# EAGLE schematic 31813C (EAGLE 7.5.0)

## Sheet 1 of 2
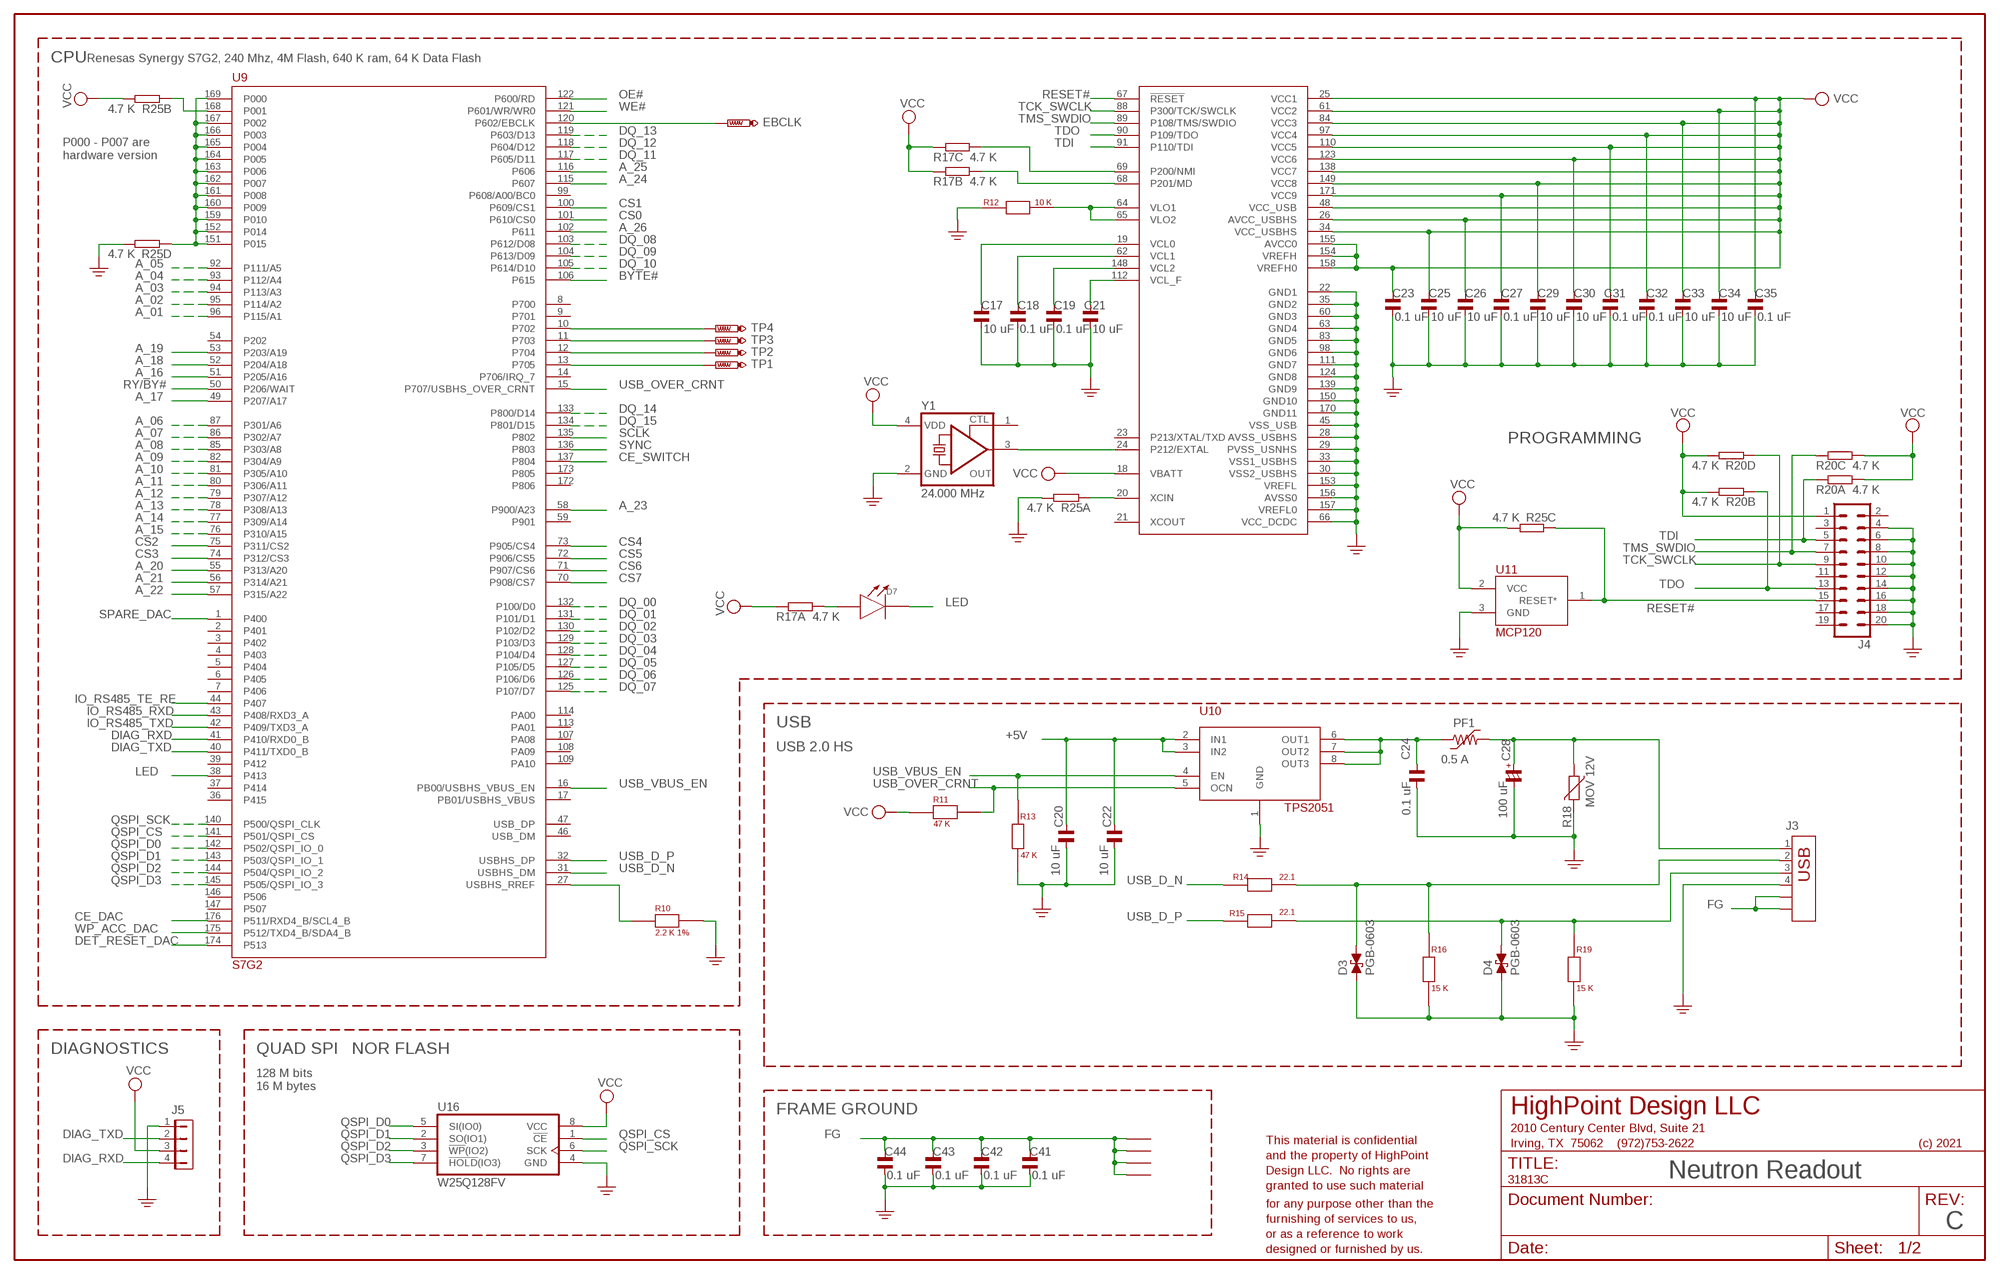
[diagram p0: schematic, sheet 1]

### Parts
C17  10 uF  CAP_SMD-0603  [0603]
C18  0.1 uF  CAP_SMD-0603  [0603]
C19  0.1 uF  CAP_SMD-0603  [0603]
C20  10 uF  CAP_SMD-0603  [0603]
C21  10 uF  CAP_SMD-0603  [0603]
C22  10 uF  CAP_SMD-0603  [0603]
C23  0.1 uF  CAP_SMD-0603  [0603]
C24  0.1 uF  CAP_SMD-0603  [0603]
C25  10 uF  CAP_SMD-0603  [0603]
C26  10 uF  CAP_SMD-0603  [0603]
C27  0.1 uF  CAP_SMD-0603  [0603]
C28  100 uF  CAP_POL-E  [CSV-E/F]
C29  10 uF  CAP_SMD-0603  [0603]
C30  10 uF  CAP_SMD-0603  [0603]
C31  0.1 uF  CAP_SMD-0603  [0603]
C32  0.1 uF  CAP_SMD-0603  [0603]
C33  10 uF  CAP_SMD-0603  [0603]
C34  10 uF  CAP_SMD-0603  [0603]
C35  0.1 uF  CAP_SMD-0603  [0603]
C41  0.1 uF  CAP_SMD-0603  [0603]
C42  0.1 uF  CAP_SMD-0603  [0603]
C43  0.1 uF  CAP_SMD-0603  [0603]
C44  0.1 uF  CAP_SMD-0603  [0603]
D3  PGB-0603  [PGB-0603]
D4  PGB-0603  [PGB-0603]
D7  LED0805  [D0805]
EBCLK  TP  [TP8040]
J3  CON-USB-292303-1  [USB]
J4  ML20  [ML20]
J5  MTA04  [MTA04-100]
M1  MNT-125  [MNT-125]
M2  MNT-125  [MNT-125]
M3  MNT-125  [MNT-125]
M4  MNT-125  [MNT-125]
PF1  0.5 A  PTC-F1206  [F1206]
R10  2.2 K 1%  RES-0603-H  [0603]
R11  47 K  RES-0603-H  [0603]
R12  10 K  RES-0603-H  [0603]
R13  47 K  RES-0603-V  [0603]
R14  22.1  RES-0603-H  [0603]
R15  22.1  RES-0603-H  [0603]
R16  15 K  RES-0603-V  [0603]
R17  4.7 K  R_38V  [RNET-4R-38V]
R18  MOV 12V  VARISTOR-0603  [R0603]
R19  15 K  RES-0603-V  [0603]
R20  4.7 K  R_38V  [RNET-4R-38V]
R25  4.7 K  R_38V  [RNET-4R-38V]
TP1  TP  [TP8040]
TP2  TP  [TP8040]
TP3  TP  [TP8040]
TP4  TP  [TP8040]
U9  S7G2  S7G2-176  [LQFP176]
U10  TPS2051  [SOIC-8-SPECIAL]
U11  MCP120  [SOT23]
U16  W25Q128FV  IS25LQ080B-JB  [SO08-JB]
Y1  24.000 MHz  ASFL1  [ASFL1]

### Nets
+5V: C20.2 C22.2 U10.2(IN1) U10.3(IN2) ; also sheet 2
A_01: U9.96(P115/A1) ; also sheet 2
A_02: U9.95(P114/A2) ; also sheet 2
A_03: U9.94(P113/A3) ; also sheet 2
A_04: U9.93(P112/A4) ; also sheet 2
A_05: U9.92(P111/A5) ; also sheet 2
A_06: U9.87(P301/A6) ; also sheet 2
A_07: U9.86(P302/A7) ; also sheet 2
A_08: U9.85(P303/A8) ; also sheet 2
A_09: U9.82(P304/A9) ; also sheet 2
A_10: U9.81(P305/A10) ; also sheet 2
A_11: U9.80(P306/A11) ; also sheet 2
A_12: U9.79(P307/A12) ; also sheet 2
A_13: U9.78(P308/A13) ; also sheet 2
A_14: U9.77(P309/A14) ; also sheet 2
A_15: U9.76(P310/A15) ; also sheet 2
A_16: U9.51(P205/A16) ; also sheet 2
A_17: U9.49(P207/A17) ; also sheet 2
A_18: U9.52(P204/A18) ; also sheet 2
A_19: U9.53(P203/A19) ; also sheet 2
A_20: U9.55(P313/A20) ; also sheet 2
A_21: U9.56(P314/A21) ; also sheet 2
A_22: U9.57(P315/A22) ; also sheet 2
A_23: U9.58(P900/A23) ; also sheet 2
A_24: U9.115(P607) ; also sheet 2
A_25: U9.116(P606) ; also sheet 2
A_26: U9.102(P611) ; also sheet 2
BYTE#: U9.106(P615) ; also sheet 2
CE_DAC: U9.176(P511/RXD4_B/SCL4_B) ; also sheet 2
CE_SWITCH: U9.137(P804) ; also sheet 2
CS0: U9.101(P610/CS0) ; also sheet 2
CS1: U9.100(P609/CS1) ; also sheet 2
CS2: U9.75(P311/CS2) ; also sheet 2
CS3: U9.74(P312/CS3) ; also sheet 2
CS4: U9.73(P905/CS4) ; also sheet 2
CS5: U9.72(P906/CS5) ; also sheet 2
CS6: U9.71(P907/CS6) ; also sheet 2
CS7: U9.70(P908/CS7) ; also sheet 2
DET_RESET_DAC: U9.174(P513) ; also sheet 2
DIAG_RXD: J5.4 U9.41(P410/RXD0_B)
DIAG_TXD: J5.2 U9.40(P411/TXD0_B)
DQ_00: U9.132(P100/D0) ; also sheet 2
DQ_01: U9.131(P101/D1) ; also sheet 2
DQ_02: U9.130(P102/D2) ; also sheet 2
DQ_03: U9.129(P103/D3) ; also sheet 2
DQ_04: U9.128(P104/D4) ; also sheet 2
DQ_05: U9.127(P105/D5) ; also sheet 2
DQ_06: U9.126(P106/D6) ; also sheet 2
DQ_07: U9.125(P107/D7) ; also sheet 2
DQ_08: U9.103(P612/D08) ; also sheet 2
DQ_09: U9.104(P613/D09) ; also sheet 2
DQ_10: U9.105(P614/D10) ; also sheet 2
DQ_11: U9.117(P605/D11) ; also sheet 2
DQ_12: U9.118(P604/D12) ; also sheet 2
DQ_13: U9.119(P603/D13) ; also sheet 2
DQ_14: U9.133(P800/D14) ; also sheet 2
DQ_15: U9.134(P801/D15) ; also sheet 2
FG: C41.2 C42.2 C43.2 C44.2 J3.S1 J3.S2 M1.1 M2.1 M3.1 M4.1
GND: C17.1 C18.1 C19.1 C20.1 C21.1 C22.1 C23.1 C24.1 C25.1 C26.1 C27.1 C28.- C29.1 C30.1 C31.1 C32.1 C33.1 C34.1 C35.1 C41.1 C42.1 C43.1 C44.1 D3.1 D4.1 J3.4 J4.4 J4.6 J4.8 J4.10 J4.12 J4.14 J4.16 J4.18 J4.20 J5.1 R10.2 R12.1 R13.1 R16.1 R18.2 R19.1 R25.5 R25.8 U9.22(GND1) U9.28(AVSS_USBHS) U9.29(PVSS_USNHS) U9.30(VSS2_USBHS) U9.33(VSS1_USBHS) U9.35(GND2) U9.45(VSS_USB) U9.60(GND3) U9.63(GND4) U9.66(VCC_DCDC) U9.83(GND5) U9.98(GND6) U9.111(GND7) U9.124(GND8) U9.139(GND9) U9.150(GND10) U9.153(VREFL) U9.156(AVSS0) U9.157(VREFL0) U9.170(GND11) U10.1(GND) U11.3(GND) U16.4(GND) Y1.2(GND) ; supply symbol labelled GND-DIGITAL ; also sheet 2
IO_RS485_RXD: U9.43(P408/RXD3_A) ; also sheet 2
IO_RS485_TE_RE: U9.44(P407) ; also sheet 2
IO_RS485_TXD: U9.42(P409/TXD3_A) ; also sheet 2
LED: D7.C U9.38(P413)
N$1: R12.2 U9.64(VLO1) U9.65(VLO2)
N$2: R17.7 U9.68(P201/MD)
N$3: R17.6 U9.69(P200/NMI)
N$4: C17.2 U9.19(VCL0)
N$5: C18.2 U9.62(VCL1)
N$6: C19.2 U9.148(VCL2)
N$7: C21.2 U9.112(VCL_F)
N$8: U9.24(P212/EXTAL) Y1.3(OUT)
N$11: C24.2 PF1.1 U10.6(OUT1) U10.7(OUT2) U10.8(OUT3)
N$12: C28.+ J3.1 PF1.2 R18.1
N$13: D3.2 J3.2 R14.2 R16.2
N$14: R10.1 U9.27(USBHS_RREF)
N$15: D4.2 J3.3 R15.2 R19.2
N$23: TP3.1(TP) U9.11(P703)
N$24: TP4.1(TP) U9.10(P702)
N$25: TP1.1(TP) U9.13(P705)
N$26: TP2.1(TP) U9.12(P704)
N$36: R25.1 U9.20(XCIN)
N$37: D7.A R17.8
N$38: R25.2 U9.168(P001)
N$39: R25.4 U9.151(P015) U9.152(P014) U9.159(P010) U9.160(P009) U9.161(P008) U9.162(P007) U9.163(P006) U9.164(P005) U9.165(P004) U9.166(P003) U9.167(P002) U9.169(P000)
N$41: EBCLK.1(TP) U9.120(P602/EBCLK)
OE#: U9.122(P600/RD) ; also sheet 2
QSPI_CS: U9.141(P501/QSPI_CS) U16.1(!CE!)
QSPI_D0: U9.142(P502/QSPI_IO_0) U16.5(SI(IO0))
QSPI_D1: U9.143(P503/QSPI_IO_1) U16.2(SO(IO1))
QSPI_D2: U9.144(P504/QSPI_IO_2) U16.3(!WP!(IO2))
QSPI_D3: U9.145(P505/QSPI_IO_3) U16.7(!HOLD!(IO3))
QSPI_SCK: U9.140(P500/QSPI_CLK) U16.6(SCK)
RESET#: J4.15 R25.3 U9.67(!RESET) U11.1(RESET*)
RY/BY#: U9.50(P206/WAIT) ; also sheet 2
SCLK: U9.135(P802) ; also sheet 2
SPARE_DAC: U9.1(P400) ; also sheet 2
SYNC: U9.136(P803) ; also sheet 2
TCK_SWCLK: J4.9 R20.4 U9.88(P300/TCK/SWCLK)
TDI: J4.5 R20.1 U9.91(P110/TDI)
TDO: J4.13 R20.2 U9.90(P109/TDO)
TMS_SWDIO: J4.7 R20.3 U9.89(P108/TMS/SWDIO)
USB_D_N [diff pairs]: R14.1 U9.31(USBHS_DM)
USB_D_P [diff pairs]: R15.1 U9.32(USBHS_DP)
USB_OVER_CRNT: R11.2 U9.15(P707/USBHS_OVER_CRNT) U10.5(OCN)
USB_VBUS_EN: R13.2 U9.16(PB00/USBHS_VBUS_EN) U10.4(EN)
VCC: C23.2 C25.2 C26.2 C27.2 C29.2 C30.2 C31.2 C32.2 C33.2 C34.2 C35.2 J4.1 J5.3 R11.1 R17.1 R17.2 R17.3 R20.5 R20.6 R20.7 R20.8 R25.6 R25.7 U9.18(VBATT) U9.25(VCC1) U9.26(AVCC_USBHS) U9.34(VCC_USBHS) U9.48(VCC_USB) U9.61(VCC2) U9.84(VCC3) U9.97(VCC4) U9.110(VCC5) U9.123(VCC6) U9.138(VCC7) U9.149(VCC8) U9.154(VREFH) U9.155(AVCC0) U9.158(VREFH0) U9.171(VCC9) U11.2(VCC) U16.8(VCC) Y1.4(VDD) ; also sheet 2
WE#: U9.121(P601/WR/WR0) ; also sheet 2
WP_ACC_DAC: U9.175(P512/TXD4_B/SDA4_B) ; also sheet 2
Unconnected: J4.2 J4.3 J4.11 J4.17 J4.19 R17.4 R17.5 U9.2(P401) U9.3(P402) U9.4(P403) U9.5(P404) U9.6(P405) U9.7(P406) U9.8(P700) U9.9(P701) U9.14(P706/IRQ_7) U9.17(PB01/USBHS_VBUS) U9.21(XCOUT) U9.23(P213/XTAL/TXD) U9.36(P415) U9.37(P414) U9.39(P412) U9.46(USB_DM) U9.47(USB_DP) U9.54(P202) U9.59(P901) U9.99(P608/A00/BC0) U9.107(PA08) U9.108(PA09) U9.109(PA10) U9.113(PA01) U9.114(PA00) U9.146(P506) U9.147(P507) U9.172(P806) U9.173(P805) Y1.1(CTL)

### Notes on the sheet
- CPU | Renesas Synergy S7G2, 240 Mhz, 4M Flash, 640 K ram, 64 K Data Flash
- P000 - P007 are
  hardware version
- PROGRAMMING
- USB
- USB 2.0 HS
- DIAGNOSTICS | QUAD SPI   NOR FLASH
- 128 M bits
  16 M bytes
- FRAME GROUND
- Neutron Readout
- C

## Sheet 2 of 2
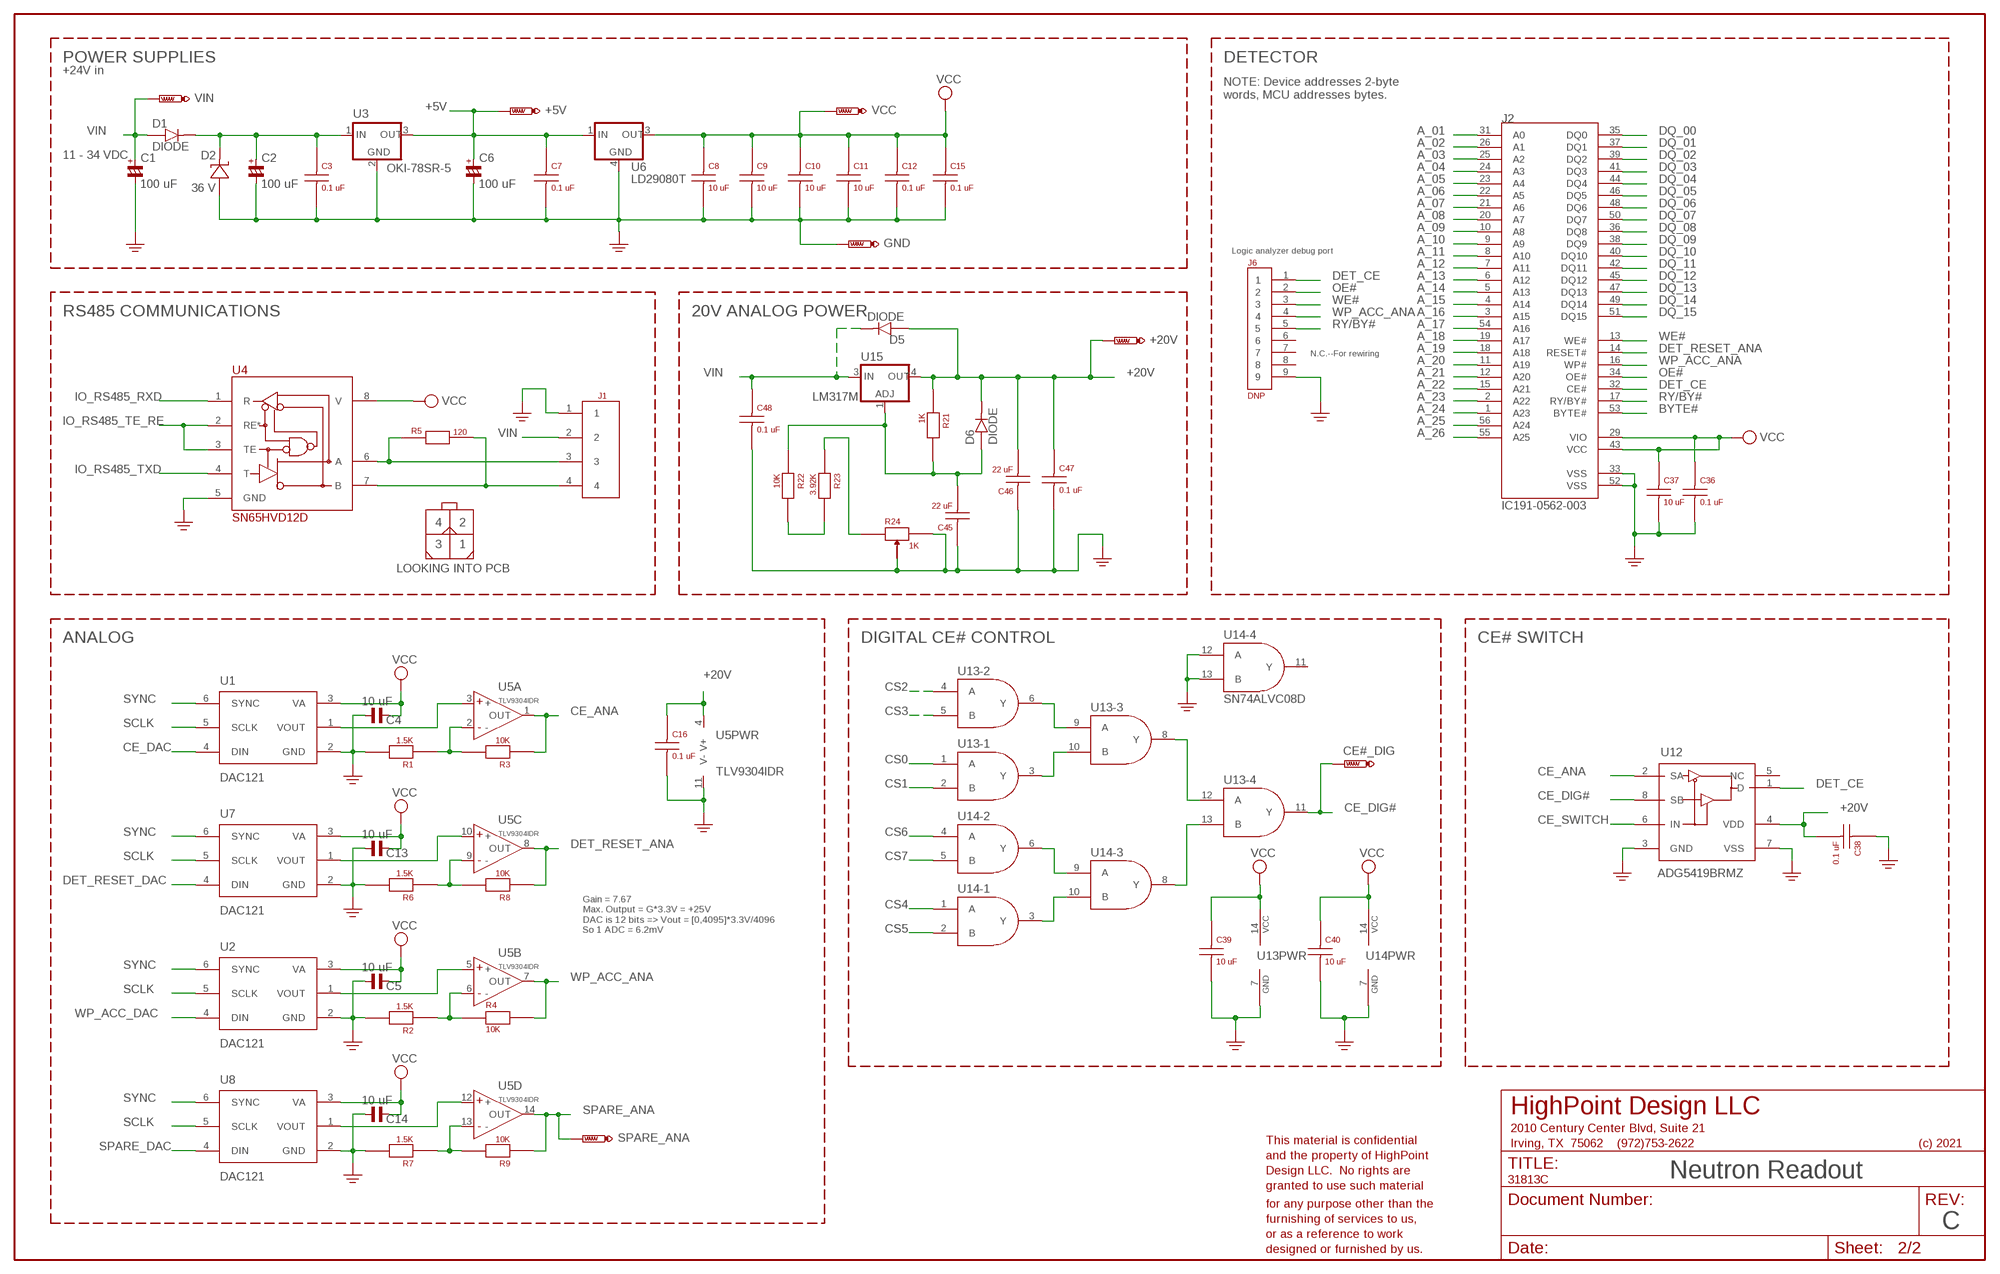
[diagram p1: schematic, sheet 2]

### Parts
+5V  TP  [TP8040]
+20V  TP  [TP8040]
C1  100 uF  CAP_POL-E  [CSV-E/F]
C2  100 uF  CAP_POL-E  [CSV-E/F]
C3  0.1 uF  CAP-0603  [0603]
C4  10 uF  CAP_SMD-0603  [0603]
C5  10 uF  CAP_SMD-0603  [0603]
C6  100 uF  CAP_POL-E  [CSV-E/F]
C7  0.1 uF  CAP-0603  [0603]
C8  10 uF  CAP-0603  [0603]
C9  10 uF  CAP-0603  [0603]
C10  10 uF  CAP-0603  [0603]
C11  10 uF  CAP-0603  [0603]
C12  0.1 uF  CAP-0603  [0603]
C13  10 uF  CAP_SMD-0603  [0603]
C14  10 uF  CAP_SMD-0603  [0603]
C15  0.1 uF  CAP-0603  [0603]
C16  0.1 uF  CAP-0603  [0603]
C36  0.1 uF  CAP-0603  [0603]
C37  10 uF  CAP-0603  [0603]
C38  0.1 uF  CAP-0603  [0603]
C39  10 uF  CAP-0603  [0603]
C40  10 uF  CAP-0603  [0603]
C45  22 uF  CAP-1206  [C1206]
C46  22 uF  CAP-1206  [C1206]
C47  0.1 uF  CAP-0603  [0603]
C48  0.1 uF  CAP-0603  [0603]
CE#_DIG  TP  [TP8040]
D1  DIODE  [SOD-123_MINI-SMA]
D2  36 V  TRANSORB  [SMB]
D5  DIODE  [SOD-123_MINI-SMA]
D6  DIODE  [SOD-123_MINI-SMA]
GND  TP  [TP8040]
J1  MICRO-FIT-4POS  [43045-0412]
J2  IC191-0562-003  [IC1910562003]
J6  DNP  CON-9P-100  [9P-100]
R1  1.5K  RES-0603-H  [0603]
R2  1.5K  RES-0603-H  [0603]
R3  10K  RES-0603-H  [0603]
R4  10K  RES-0603-H  [0603]
R5  120  RES-0603-H  [0603]
R6  1.5K  RES-0603-H  [0603]
R7  1.5K  RES-0603-H  [0603]
R8  10K  RES-0603-H  [0603]
R9  10K  RES-0603-H  [0603]
R21  1K  RES-0603-H  [0603]
R22  10K  RES-0603-H  [0603]
R23  3.92K  RES-0603-H  [0603]
R24  1K  PT10XV10  [POT-V10]
SPARE_ANA  TP  [TP8040]
U1  DAC121  [SOT23-6]
U2  DAC121  [SOT23-6]
U3  OKI-78SR-5  PS-OKI-78SR  [PS-OKI-78SR]
U4  SN65HVD12D  [SOIC-08-150]
U5  TLV9304IDR  [SO14]
U6  LD29080T  [DPAK]
U7  DAC121  [SOT23-6]
U8  DAC121  [SOT23-6]
U12  ADG5419BRMZ  [RM_8_ADI]
U13  SN74ALVC08D  [D14]
U14  SN74ALVC08D  [D14]
U15  LM317M  [DPAK]
VCC  TP  [TP8040]
VIN  TP  [TP8040]

### Nets
+5V: +5V.1(TP) C6.+ C7.1 U3.3(OUT) U6.1(IN) ; also sheet 1
+20V: +20V.1(TP) C16.1 C38.2 C46.2 C47.1 D5.A D6.C R21.1 U5.4(PWR:V+) U12.4(VDD) U15.4(OUT)
A_01: J2.31(A0) ; also sheet 1
A_02: J2.26(A1) ; also sheet 1
A_03: J2.25(A2) ; also sheet 1
A_04: J2.24(A3) ; also sheet 1
A_05: J2.23(A4) ; also sheet 1
A_06: J2.22(A5) ; also sheet 1
A_07: J2.21(A6) ; also sheet 1
A_08: J2.20(A7) ; also sheet 1
A_09: J2.10(A8) ; also sheet 1
A_10: J2.9(A9) ; also sheet 1
A_11: J2.8(A10) ; also sheet 1
A_12: J2.7(A11) ; also sheet 1
A_13: J2.6(A12) ; also sheet 1
A_14: J2.5(A13) ; also sheet 1
A_15: J2.4(A14) ; also sheet 1
A_16: J2.3(A15) ; also sheet 1
A_17: J2.54(A16) ; also sheet 1
A_18: J2.19(A17) ; also sheet 1
A_19: J2.18(A18) ; also sheet 1
A_20: J2.11(A19) ; also sheet 1
A_21: J2.12(A20) ; also sheet 1
A_22: J2.15(A21) ; also sheet 1
A_23: J2.2(A22) ; also sheet 1
A_24: J2.1(A23) ; also sheet 1
A_25: J2.56(A24) ; also sheet 1
A_26: J2.55(A25) ; also sheet 1
BYTE#: J2.53(BYTE#) ; also sheet 1
CE_ANA: R3.1 U5.1(A:OUT) U12.2(SA)
CE_DAC: U1.4(DIN) ; also sheet 1
CE_DIG#: CE#_DIG.1(TP) U12.8(SB) U13.11(-4:Y)
CE_SWITCH: U12.6(IN) ; also sheet 1
CS0: U13.1(-1:A) ; also sheet 1
CS1: U13.2(-1:B) ; also sheet 1
CS2: U13.4(-2:A) ; also sheet 1
CS3: U13.5(-2:B) ; also sheet 1
CS4: U14.1(-1:A) ; also sheet 1
CS5: U14.2(-1:B) ; also sheet 1
CS6: U14.4(-2:A) ; also sheet 1
CS7: U14.5(-2:B) ; also sheet 1
DATA_N [diff pairs]: J1.4 R5.2 U4.7(B)
DATA_P [diff pairs]: J1.3 R5.1 U4.6(A)
DET_CE: J2.32(CE#) J6.1 U12.1(D)
DET_RESET_ANA: J2.14(RESET#) R8.1 U5.8(C:OUT)
DET_RESET_DAC: U7.4(DIN) ; also sheet 1
DQ_00: J2.35(DQ0) ; also sheet 1
DQ_01: J2.37(DQ1) ; also sheet 1
DQ_02: J2.39(DQ2) ; also sheet 1
DQ_03: J2.41(DQ3) ; also sheet 1
DQ_04: J2.44(DQ4) ; also sheet 1
DQ_05: J2.46(DQ5) ; also sheet 1
DQ_06: J2.48(DQ6) ; also sheet 1
DQ_07: J2.50(DQ7) ; also sheet 1
DQ_08: J2.36(DQ8) ; also sheet 1
DQ_09: J2.38(DQ9) ; also sheet 1
DQ_10: J2.40(DQ10) ; also sheet 1
DQ_11: J2.42(DQ11) ; also sheet 1
DQ_12: J2.45(DQ12) ; also sheet 1
DQ_13: J2.47(DQ13) ; also sheet 1
DQ_14: J2.49(DQ14) ; also sheet 1
DQ_15: J2.51(DQ15) ; also sheet 1
GND: C1.- C2.- C3.2 C4.1 C5.1 C6.- C7.2 C8.2 C9.2 C10.2 C11.2 C12.2 C13.1 C14.1 C15.2 C16.2 C36.2 C37.2 C38.1 C39.2 C40.2 C45.1 C46.1 C47.2 C48.2 D2.A GND.1(TP) J1.1 J2.33(VSS) J2.52(VSS) J6.9 R1.2 R2.2 R6.2 R7.2 R24.2 R24.3 U1.2(GND) U2.2(GND) U3.2(GND) U4.5(GND) U5.11(PWR:V-) U6.4(GND) U7.2(GND) U8.2(GND) U12.3(GND) U12.7(VSS) U13.7(PWR:GND) U14.7(PWR:GND) U14.12(-4:A) U14.13(-4:B) ; supply symbol labelled GND-DIGITAL ; also sheet 1
IO_RS485_RXD: U4.1(R) ; also sheet 1
IO_RS485_TE_RE: U4.2(RE*) U4.3(TE) ; also sheet 1
IO_RS485_TXD: U4.4(T) ; also sheet 1
N$9: U1.1(VOUT) U5.3(A:+)
N$10: U5.10(C:+) U7.1(VOUT)
N$16: R1.1 R3.2 U5.2(A:-)
N$17: U2.1(VOUT) U5.5(B:+)
N$18: R6.1 R8.2 U5.9(C:-)
N$19: R2.1 R4.1 U5.6(B:-)
N$20: U5.12(D:+) U8.1(VOUT)
N$21: R7.1 R9.2 U5.13(D:-)
N$22: C2.+ C3.1 D1.C D2.C U3.1(IN)
N$27: U13.6(-2:Y) U13.9(-3:A)
N$28: U13.3(-1:Y) U13.10(-3:B)
N$29: U14.6(-2:Y) U14.9(-3:A)
N$30: U14.3(-1:Y) U14.10(-3:B)
N$31: U13.8(-3:Y) U13.12(-4:A)
N$32: U13.13(-4:B) U14.8(-3:Y)
N$33: C45.2 D6.A R21.2 R22.1 U15.1(ADJ)
N$34: R22.2 R23.2
N$35: R23.1 R24.1
OE#: J2.34(OE#) J6.2 ; also sheet 1
RY/BY#: J2.17(RY/BY#) J6.5 ; also sheet 1
SCLK: U1.5(SCLK) U2.5(SCLK) U7.5(SCLK) U8.5(SCLK) ; also sheet 1
SPARE_ANA: R9.1 SPARE_ANA.1(TP) U5.14(D:OUT)
SPARE_DAC: U8.4(DIN) ; also sheet 1
SYNC: U1.6(SYNC) U2.6(SYNC) U7.6(SYNC) U8.6(SYNC) ; also sheet 1
VCC: C4.2 C5.2 C8.1 C9.1 C10.1 C11.1 C12.1 C13.2 C14.2 C15.1 C36.1 C37.1 C39.1 C40.1 J2.29(VIO) J2.43(VCC) U1.3(VA) U2.3(VA) U4.8(V) U6.3(OUT) U7.3(VA) U8.3(VA) U13.14(PWR:VCC) U14.14(PWR:VCC) VCC.1(TP) ; also sheet 1
VIN: C1.+ C48.1 D1.A D5.C J1.2 U15.3(IN) VIN.1(TP)
WE#: J2.13(WE#) J6.3 ; also sheet 1
WP_ACC_ANA: J2.16(WP#) J6.4 R4.2 U5.7(B:OUT)
WP_ACC_DAC: U2.4(DIN) ; also sheet 1
Unconnected: J6.6 J6.7 J6.8 U12.5(NC) U14.11(-4:Y)

### Notes on the sheet
- POWER SUPPLIES | DETECTOR
- +24V in
- NOTE: Device addresses 2-byte
  words, MCU addresses bytes.
- 11 - 34 VDC
- Logic analyzer debug port
- RS485 COMMUNICATIONS | 20V ANALOG POWER
- N.C.--For rewiring
- ANALOG | DIGITAL CE# CONTROL | CE# SWITCH
- Gain = 7.67
  Max. Output = G*3.3V = +25V
  DAC is 12 bits => Vout = [0,4095]*3.3V/4096
  So 1 ADC = 6.2mV
- Neutron Readout
- C

## Library data of the parts
+5V +20V CE#_DIG EBCLK GND SPARE_ANA TP1-TP4 VCC VIN = 31813 Neutron Readout PCB:TP: TEST PIN
C1 C2 C6 C28 = 31813 Neutron Readout PCB:CAP_POL: Polarized caps surface mount
C3 C7-C12 C15 C16 C36-C40 C45-C48 = 31813 Neutron Readout PCB:CAP: Surfave mount caps various sizes all non-polar
C4 C5 C13 C14 C17-C27 C29-C35 C41-C44 = 31813 Neutron Readout PCB:CAP_SMD: Surface mount caps
D1 D5 D6 = 31813 Neutron Readout PCB:DIODE: General purpose diode
D2 = 31813 Neutron Readout PCB:TRANSORB: 600 watt transorb smb style smd, 400 watt sma style
D3 D4 = 31813 Neutron Readout PCB:PGB-0603: ESD SUPPRESSOR
D7 = 31813 Neutron Readout PCB:LED
J1 = 31813 Neutron Readout PCB:MICRO-FIT-4POS: Micro Fit 3.0 male header 4 position
J2 = 31813 Neutron Readout PCB:IC191-0562-003: IC & Component Sockets 56Pin TSOP Burn-in Skt 0.50 pitch Source: Datasheet; DESCRIPTION: IC & Component Sockets 56Pin TSOP Burn-in Skt 0.50 pitch; HEIGHT: 19.2mm; MANUFACTURER_NAME: Yamaichi; MANUFACTURER_PART_NUMBER: IC191-0562-003; MOUSER_PART_NUMBER: 945-IC191-0562-003; MOUSER_PRICE-STOCK: https://www.mouser.com/Search/Refine.aspx?Keyword=945-IC191-0562-003
J3 = 31813 Neutron Readout PCB:CON-USB-292303-1: AMP connector
J4 = 31813 Neutron Readout PCB:ML20: HARTING
J5 = 31813 Neutron Readout PCB:MTA04: AMP connector
J6 = 31813 Neutron Readout PCB:CON-9P-100
M1-M4 = 31813 Neutron Readout PCB:MNT: Mounting holes
PF1 = 31813 Neutron Readout PCB:PTC-: POLYSWITCH Polyswitch Resetable Fuses
R1-R12 R14 R15 R21-R23 = 31813 Neutron Readout PCB:RES-0603-H: Resistor 0603 package horizontal schematic symbol
R13 R16 R19 = 31813 Neutron Readout PCB:RES-0603-V: Resistor 0603 package vertical schematic symbol
R17 R20 R25 = 31813 Neutron Readout PCB:R_38V: SMT resistor pack 4 resistors, Pabnasonic 38V, Rohm MNR14
R18 = 31382 Display PCB:VARISTOR: VARISTOR
R24 = 31813 Neutron Readout PCB:PT10XV10
U1 U2 U7 U8 = 31813 Neutron Readout PCB:DAC121: TI DAC121 Digital to Analog Converter
U3 = 31813 Neutron Readout PCB:PS-OKI-78SR: Murata OKI 5W 7-32 Vin Regulator
U4 = 31813 Neutron Readout PCB:SN65HVD12D: 3.3 V RS485 tranceiver - Texas Instruments
U5 = 31813 Neutron Readout PCB:TLV9304: Texas Instruments TLV9304 Opamp
U6 = 31382 Display PCB:LD29080: LDO Regulator LD29150 series
U9 = 31813 Neutron Readout PCB:S7G2-176: Synergy S7G2 - LQFP 176
U10 = 31813 Neutron Readout PCB:TPS2051
U11 = 31813 Neutron Readout PCB:MCP120: Three pin reset - supervisor circuit with fixed delay, open drain
U12 = 31813 Neutron Readout PCB:ADG5419BRMZ; BUILT_BY: EMA_UL_Team; MANUFACTURER_PART_NUMBER: ADG5419BRMZ; SOURCELIBRARY: Analog_2015-12-15; VENDOR: Analog Devices Inc
U13 U14 = 31813 Neutron Readout PCB:SN74ALVC08D; DATASHEET_URL: http://www.ti.com/lit/gpn/SN74ALVC08; DESCRIPTION: Quadruple 2-Input Positive-AND Gate; FAMILY_NAME: AND GATE; GENERIC_PART_NUMBER: SN74ALVC08; INDUSTRY_STD_PKG_TYPE: SOIC; MANUFACTURER: Texas Instruments; MANUFACTURER_PART_NUMBER: SN74ALVC08D; PACKAGE_DESIGNATOR: D; PIN_COUNT: 14; VENDOR: Texas Instruments
U15 = 31813 Neutron Readout PCB:LM317M
U16 = 31813 Neutron Readout PCB:IS25LQ080B-: EEPROM - 8 Mbit Serial Flash 3V QUAD SERIAL FLASH MEMORY WITH MULTI-I/O SPI
Y1 = 31813 Neutron Readout PCB:ASFL1: CRYSTAL OSCILLATOR - Abracon

## Net classes
1 diff pairs: width 0.203 mm